# EAGLE design loki (EAGLE 6.2)
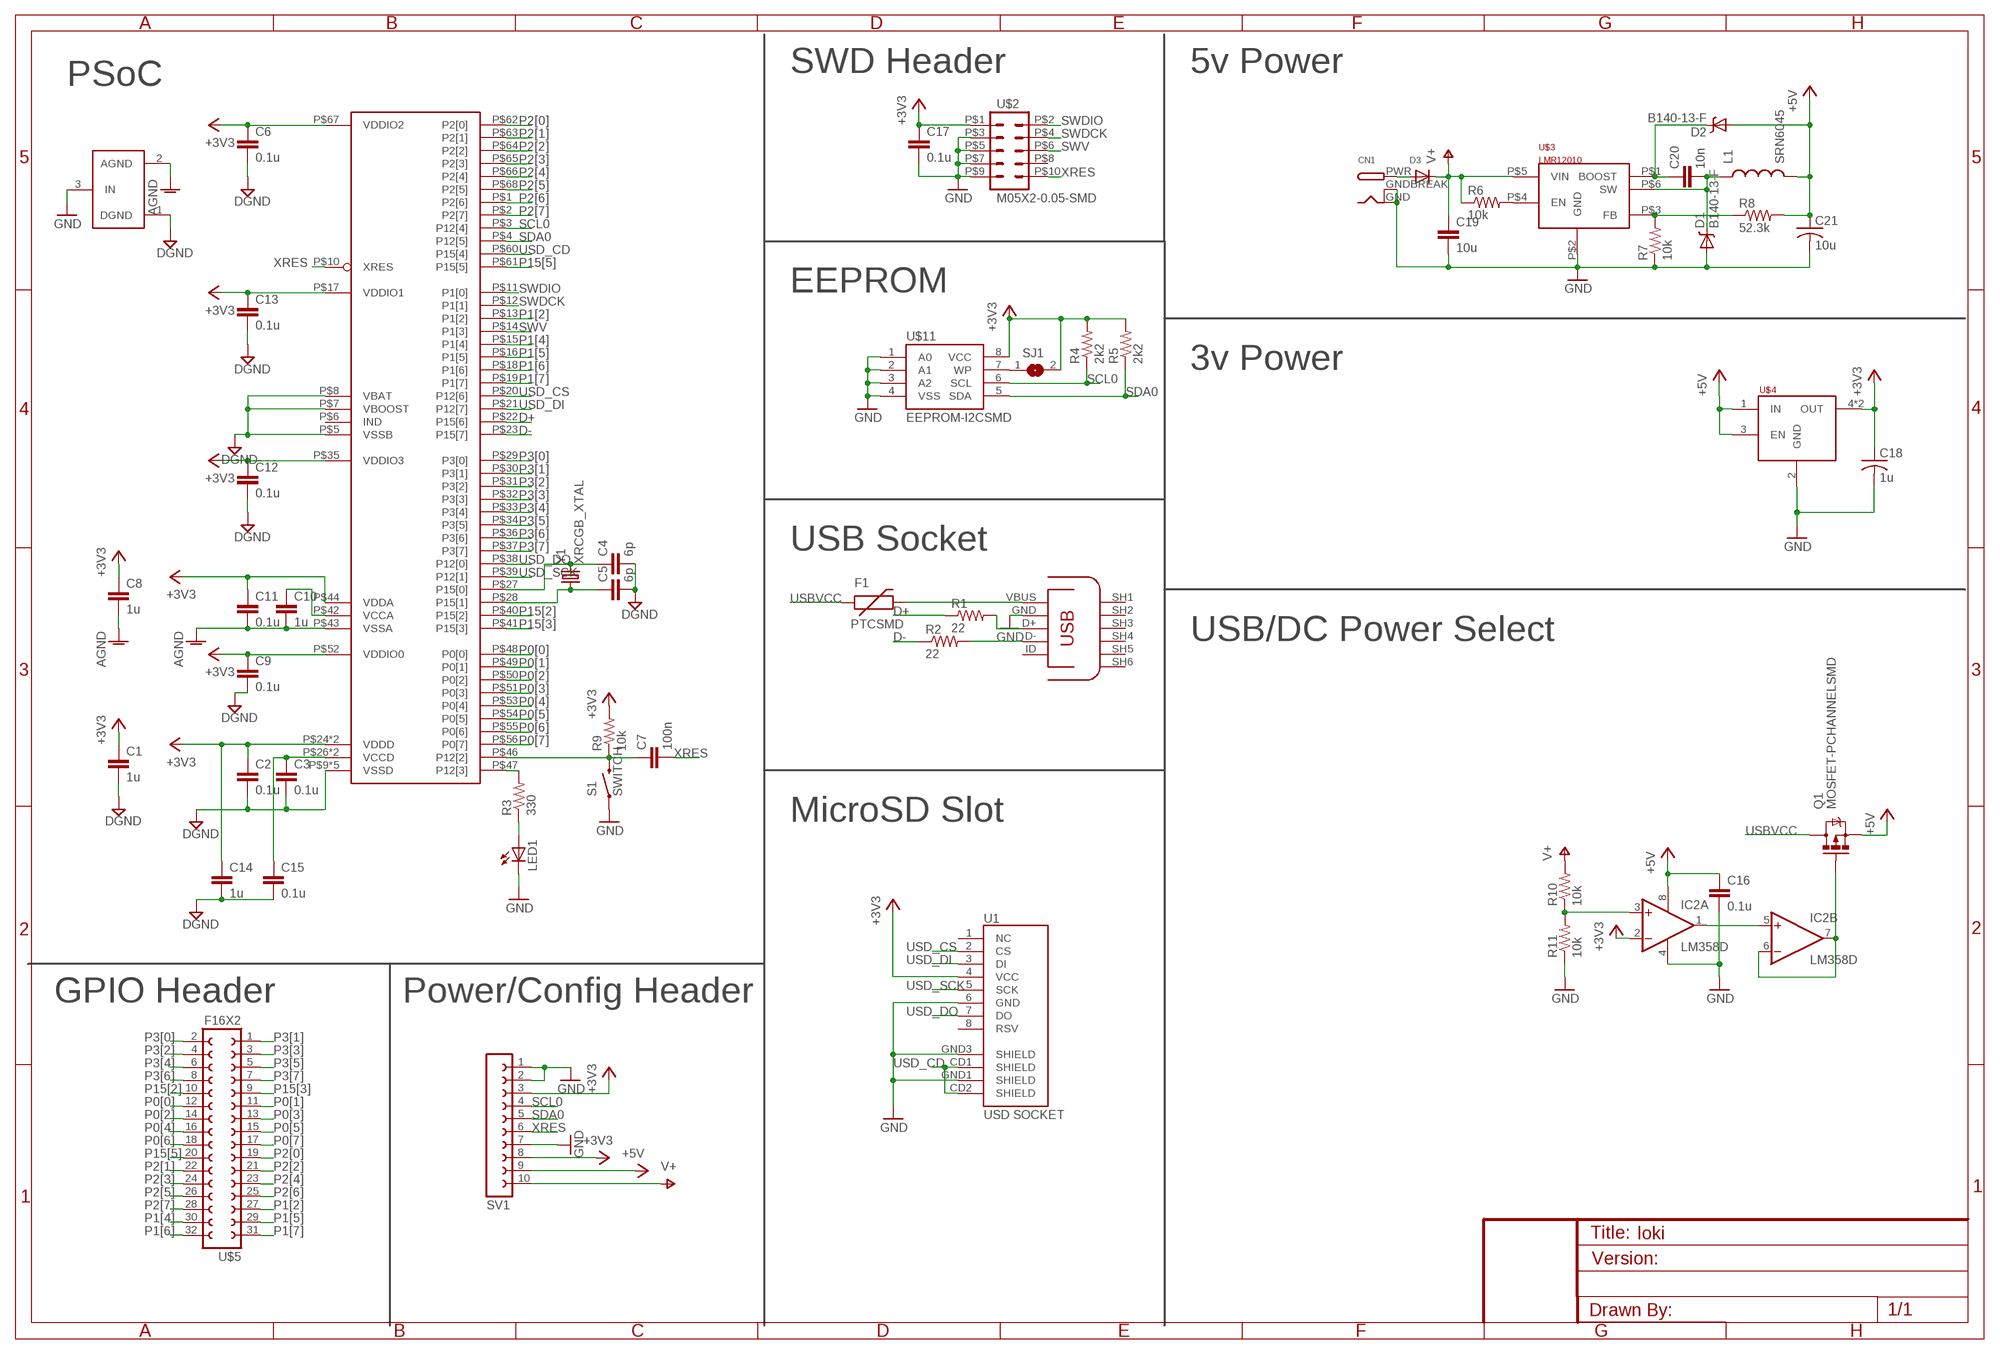
[diagram p0: schematic, sheet 1]

## Parts
C1  1u  C-EUC0603K  [C0603K]
C2  0.1u  C-EUC0603K  [C0603K]
C3  0.1u  C-EUC0603K  [C0603K]
C4  6p  C-EUC0603K  [C0603K]
C5  6p  C-EUC0603K  [C0603K]
C6  0.1u  C-EUC0603K  [C0603K]
C7  100n  C-EUC0603K  [C0603K]
C8  1u  C-EUC0603K  [C0603K]
C9  0.1u  C-EUC0603K  [C0603K]
C10  1u  C-EUC0603K  [C0603K]
C11  0.1u  C-EUC0603K  [C0603K]
C12  0.1u  C-EUC0603K  [C0603K]
C13  0.1u  C-EUC0603K  [C0603K]
C14  1u  C-EUC0603K  [C0603K]
C15  0.1u  C-EUC0603K  [C0603K]
C16  0.1u  CAP0603-CAP  [0603-CAP]
C17  0.1u  C-EUC0603K  [C0603K]
C18  1u  C-USC0603  [C0603]
C19  10u  C-EUC1210  [C1210]
C20  10n  C-EUC0805  [C0805]
C21  10u  C-USC1206  [C1206]
CN1  DCBARRELPTH  [DCJACK_2MM_PTH]
D1  B140-13-F  DIODE-SCHOTTKY_  [SMA-DIODE]
D2  B140-13-F  DIODE-SCHOTTKY_  [SMA-DIODE]
D3  DIODESMA  [SMADIODE]
F1  PTCSMD  [PTC-1206]
IC2  LM358D  [SO08]
L1  SRN6045  [SRN6045]
LED1  LEDCHIP-LED0805  [CHIP-LED0805]
Q1  MOSFET-PCHANNELSMD  [SOT23-3]
R1  22  RESISTOR0603-RES  [0603-RES]
R2  22  RESISTOR0603-RES  [0603-RES]
R3  330  R-US_R0603  [R0603]
R4  2k2  R-US_R0603  [R0603]
R5  2k2  R-US_R0603  [R0603]
R6  10k  R-US_R0603  [R0603]
R7  10k  R-US_R0603  [R0603]
R8  52.3k  R-US_R0603  [R0603]
R9  10k  R-US_R0603  [R0603]
R10  10k  R-US_R0603  [R0603]
R11  10k  R-US_R0603  [R0603]
S1  SWITCH  SWITCH-MOMENTARY-2SMD  [TACTILE_SWITCH_SMD]
SJ1  SJ  [SJ]
SV1  FE10-1  [FE10]
U1  USD SOCKET  USD-SOCKETNEW  [MICRO-SD-SOCKET-PP]
U$1  CY83XXX-68PIN  [QFN68]
U$2  M05X2-0.05-SMD  [PINHD-2X5-0.05-SMD]
U$3  LMR12010  [TSOT-6]
U$4  TLV702XX  [SOT23-5]
U$5  F16X2  [FE16-2]
U$7  MICROUSB  [USB-MICROB]
U$9  GND_CONNECT  [GND_CONNECT]
U$11  EEPROM-I2CSMD  [SO08]
Y1  XRCGB_XTAL  [XRCGB-XTAL]

## Nets
+3V3: C1.1 C2.1 C6.1 C8.1 C9.1 C11.1 C12.1 C13.1 C14.1 C17.1 C18.1 IC2.2(A:-IN) R4.2 R5.2 R9.2 SJ1.2 SV1.3 SV1.8 U1.4(VCC) U$1.P$17(VDDIO1) U$1.P$24(VDDD) U$1.P$35(VDDIO3) U$1.P$44(VDDA) U$1.P$52(VDDIO0) U$1.P$59(VDDD) U$1.P$67(VDDIO2) U$2.P$1 U$4.4(OUT) U$4.5(OUT) U$11.8(VCC)
+5V: C16.1 C21.1 D2.A IC2.8(P:V+) L1.P$2 Q1.2(S) R8.2 SV1.9 U$4.1(IN) U$4.3(EN)
AGND: C8.2 C10.2 C11.2 U$1.P$43(VSSA) U$9.2(AGND)
D+: R1.1 U$1.P$22(P15[6])
D-: R2.1 U$1.P$23(P15[7])
DGND: C1.2 C2.2 C3.2 C4.2 C5.2 C6.2 C9.2 C12.2 C13.2 C14.2 C15.2 U$1.P$5(VSSB) U$1.P$7(VBOOST) U$1.P$8(VBAT) U$1.P$9(VSSD) U$1.P$25(VSSD) U$1.P$45(VSSD) U$1.P$58(VSSD) U$1.P$CENTER(VSSD) U$9.1(DGND)
GND: C16.2 C17.2 C18.2 C19.2 C21.2 CN1.GND CN1.GNDBREAK D1.A IC2.4(P:V-) LED1.C R7.1 R11.1 S1.1 SV1.1 SV1.2 SV1.7 U1.6(GND) U1.GND1(SHIELD) U1.GND3(SHIELD) U$2.P$3 U$2.P$5 U$2.P$7 U$2.P$9 U$3.P$2(GND) U$4.2(GND) U$7.GND U$9.3(IN) U$11.1(A0) U$11.2(A1) U$11.3(A2) U$11.4(VSS)
N$1: C3.1 C15.1 U$1.P$26(VCCD) U$1.P$57(VCCD)
N$2: R2.2 U$7.D-
N$3: C10.1 U$1.P$42(VCCA)
N$4: R1.2 U$7.D+
N$5: R6.2 U$3.P$4(EN)
N$6: C20.1 D2.C U$3.P$1(BOOST)
N$7: C20.2 D1.C L1.P$1 U$3.P$6(SW)
N$8: R7.2 R8.1 U$3.P$3(FB)
N$9: SJ1.1 U$11.7(WP)
N$10: R3.2 U$1.P$47(P12[3])
N$11: CN1.PWR D3.A
N$12: IC2.3(A:+IN) R10.1 R11.2
N$13: IC2.6(B:-IN) IC2.7(B:OUT) Q1.1(G)
N$14: IC2.1(A:OUT) IC2.5(B:+IN)
N$15: F1.2 U$7.VBUS(VCC)
N$16: C4.1 U$1.P$27(P15[0]) Y1.2
N$17: C5.1 U$1.P$28(P15[1]) Y1.1
N$20: C7.1 R9.1 S1.3 U$1.P$46(P12[2])
N$25: LED1.A R3.1
P0[0]: U$1.P$48(P0[0]) U$5.12
P0[1]: U$1.P$49(P0[1]) U$5.11
P0[2]: U$1.P$50(P0[2]) U$5.14
P0[3]: U$1.P$51(P0[3]) U$5.13
P0[4]: U$1.P$53(P0[4]) U$5.16
P0[5]: U$1.P$54(P0[5]) U$5.15
P0[6]: U$1.P$55(P0[6]) U$5.18
P0[7]: U$1.P$56(P0[7]) U$5.17
P1[2]: U$1.P$13(P1[2]) U$5.27
P1[4]: U$1.P$15(P1[4]) U$5.30
P1[5]: U$1.P$16(P1[5]) U$5.29
P1[6]: U$1.P$18(P1[6]) U$5.32
P1[7]: U$1.P$19(P1[7]) U$5.31
P2[0]: U$1.P$62(P2[0]) U$5.19
P2[1]: U$1.P$63(P2[1]) U$5.22
P2[2]: U$1.P$64(P2[2]) U$5.21
P2[3]: U$1.P$65(P2[3]) U$5.24
P2[4]: U$1.P$66(P2[4]) U$5.23
P2[5]: U$1.P$68(P2[5]) U$5.26
P2[6]: U$1.P$1(P2[6]) U$5.25
P2[7]: U$1.P$2(P2[7]) U$5.28
P3[0]: U$1.P$29(P3[0]) U$5.2
P3[1]: U$1.P$30(P3[1]) U$5.1
P3[2]: U$1.P$31(P3[2]) U$5.4
P3[3]: U$1.P$32(P3[3]) U$5.3
P3[4]: U$1.P$33(P3[4]) U$5.6
P3[5]: U$1.P$34(P3[5]) U$5.5
P3[6]: U$1.P$36(P3[6]) U$5.8
P3[7]: U$1.P$37(P3[7]) U$5.7
P15[2]: U$1.P$40(P15[2]) U$5.10
P15[3]: U$1.P$41(P15[3]) U$5.9
P15[5]: U$1.P$61(P15[5]) U$5.20
SCL0: R4.1 SV1.4 U$1.P$3(P12[4]) U$11.6(SCL)
SDA0: R5.1 SV1.5 U$1.P$4(P12[5]) U$11.5(SDA)
SWDCK: U$1.P$12(P1[1]) U$2.P$4
SWDIO: U$1.P$11(P1[0]) U$2.P$2
SWV: U$1.P$14(P1[3]) U$2.P$6
USBVCC: F1.1 Q1.3(D)
USD_CD: U1.CD1(SHIELD) U1.CD2(SHIELD) U$1.P$60(P15[4])
USD_CS: U1.2(CS) U$1.P$20(P12[6])
USD_DI: U1.3(DI) U$1.P$21(P12[7])
USD_DO: U1.7(DO) U$1.P$38(P12[0])
USD_SCK: U1.5(SCK) U$1.P$39(P12[1])
V+: C19.1 D3.C R6.1 R10.2 SV1.10 U$3.P$5(VIN)
XRES: C7.2 SV1.6 U$1.P$10(XRES) U$2.P$10
Unconnected: U1.1(NC) U1.8(RSV) U$2.P$8 U$7.ID U$7.SH1(SH) U$7.SH2(SH) U$7.SH3(SH) U$7.SH4(SH) U$7.SH5(SH) U$7.SH6(SH)

## Notes on the sheet
- SWD Header | 5v Power
- PSoC
- EEPROM
- 3v Power
- USB Socket
- USB/DC Power Select
- MicroSD Slot
- GPIO Header | Power/Config Header

## Power pins joined to a net without a drawn wire
IND: U$1.P$6(IND)

## Library data of the parts
C1-C15 C17 C19 C20 = resistor:C-EU: CAPACITOR, European symbol
C16 = SparkFun-Passives:CAP: Capacitor Standard 0603 ceramic capacitor, and 0.1" leaded capacitor.
C18 C21 = resistor:C-US: CAPACITOR, American symbol
CN1 = adafruit:DCBARREL: 2.0mm DC Barrel Jack DCJACK_2MM_PTH - Through Hole Jack (4UConnector: 05537)
D1 D2 = SparkFun-DiscreteSemi:DIODE-SCHOTTKY: Commonly MBRA140.
D3 = adafruit:DIODE: Diode SMADIODE - SMA Surface Mount Package 20V 1A Schottky Diode Digikey: 641-1014-6-ND DO-1N4148 - Through Hole Small Current Diode SOD-123 20V 1 A (.5mV Vf) Schottky Diode - Digikey: MBRX120TPMSCT-ND SOD-323 10V 570mA (.38mV Vf, 3ns) Schottky Diode - Digikey: ZLLS410CT-ND SOD-523 30V 30mA Schottky Diode (RB751S-40TE61) - Digikey: RB751S-40TE61CT-ND SOT23-R/W - SOT23 Package (R = Solder Paste/Reflow Ovens, W = Hand-Soldering) BAT54Film 40V 300mA - Digikey: 497-7162-1-ND
F1 = SparkFun-PowerIC:PTC: Resettable Fuse PTC Resettable Fuse. Spark Fun Electronics SKU : COM-08357
IC2 = linear:LM358: OP AMP also LM158; LM258; LM2904 Source: http://cache.national.com/ds/LM/LM158.pdf
L1 = nickparts:SRN6045
LED1 = led:LED: LED OSRAM: - CHIPLED LG R971, LG N971, LY N971, LG Q971, LY Q971, LO R971, LY R971 LH N974, LH R974 LS Q976, LO Q976, LY Q976 LO Q996 - Hyper CHIPLED LW Q18S LB Q993, LB Q99A, LB R99A - SideLED LS A670, LO A670, LY A670, LG A670, LP A670 LB A673, LV A673, LT A673, LW A673 LH A674 LY A675 LS A676, LA A676, LO A676, LY A676, LW A676 LS A679, LY A679, LG A679 - Hyper Micro SIDELED® LS Y876, LA Y876, LO Y876, LY Y876 LT Y87S - SmartLED LW L88C, LW L88S LB L89C, LB L89S, LG L890 LS L89K, LO L89K, LY L89K LS L896, LA L896, LO L896, LY L896 - TOPLED LS T670, LO T670, LY T670, LG T670, LP T670 LSG T670, LSP T670, LSY T670, LOP T670, LYG T670 LG T671, LOG T671, LSG T671 LB T673, LV T673, LT T673, LW T673 LH T674 LS T676, LA T676, LO T676, LY T676, LB T676, LH T676, LSB T676, LW T676 LB T67C, LV T67C, LT T67C, LS T67K, LO T67K, LY T67K, LW E67C LS E67B, LA E67B, LO E67B, LY E67B, LB E67C, LV E67C, LT E67C LW T67C LS T679, LY T679, LG T679 LS T770, LO T770, LY T770, LG T770, LP T770 LB T773, LV T773, LT T773, LW T773 LH T774 LS E675, LA E675, LY E675, LS T675 LS T776, LA T776, LO T776, LY T776, LB T776 LHGB T686 LT T68C, LB T68C - Hyper Mini TOPLED® LB M676 - Mini TOPLED Santana® LG M470 LS M47K, LO M47K, LY M47K Source: http://www.osram.convergy.de LUXEON: - LUMILED® LXK2-PW12-R00, LXK2-PW12-S00, LXK2-PW14-U00, LXK2-PW14-V00 LXK2-PM12-R00, LXK2-PM12-S00, LXK2-PM14-U00 LXK2-PE12-Q00, LXK2-PE12-R00, LXK2-PE12-S00, LXK2-PE14-T00, LXK2-PE14-U00 LXK2-PB12-K00, LXK2-PB12-L00, LXK2-PB12-M00, LXK2-PB14-N00, LXK2-PB14-P00, LXK2-PB14-Q00 LXK2-PR12-L00, LXK2-PR12-M00, LXK2-PR14-Q00, LXK2-PR14-R00 LXK2-PD12-Q00, LXK2-PD12-R00, LXK2-PD12-S00 LXK2-PH12-R00, LXK2-PH12-S00 LXK2-PL12-P00, LXK2-PL12-Q00, LXK2-PL12-R00 Source: www.luxeon.com KINGBRIGHT: KA-3528ASYC Source: www.kingbright.com
Q1 = SparkFun-DiscreteSemi:MOSFET-PCHANNEL: Generic PMOSFET
R1 R2 = SparkFun-Passives:RESISTOR: Resistor Basic schematic elements and footprints for 0603, 1206, and PTH resistors.
R3-R11 = resistor:R-US_: RESISTOR, American symbol
S1 = SparkFun-Electromechanical:SWITCH-MOMENTARY-2: Various NO switches- pushbuttons, reed, etc
SJ1 = jumper:SJ: SMD solder JUMPER
SV1 = con-lsta:FE10-1: FEMALE HEADER; OC_FARNELL: unknown; OC_NEWARK: unknown
U1 = SparkFun-Connectors:USD-SOCKET: microSD Socket Push-push type uSD socket. Schematic element and footprint production proven. Spark Fun Electronics SKU : PRT-00127. tDoc lines correctly indicate media card edge positions when inserting (unlocked, locked, depressed).
U$1 = cypress_psoc_V1_0:CY83XXX-68PIN
U$2 = nickparts:M05X2-0.05-SMD
U$3 = nickparts:LMR12010
U$4 = nickparts:TLV702XX
U$5 = nickparts:F16X2
U$7 = ondraster:MICROUSB
U$9 = SparkFun-Passives:GND_CONNECT: Use to make a connection of multiple grounds in only one place.
U$11 = SparkFun-DigitalIC:EEPROM-I2C: I2C EEPROM chips, 24LC256 (and others)
Y1 = nickparts:XRCGB_XTAL

## Board
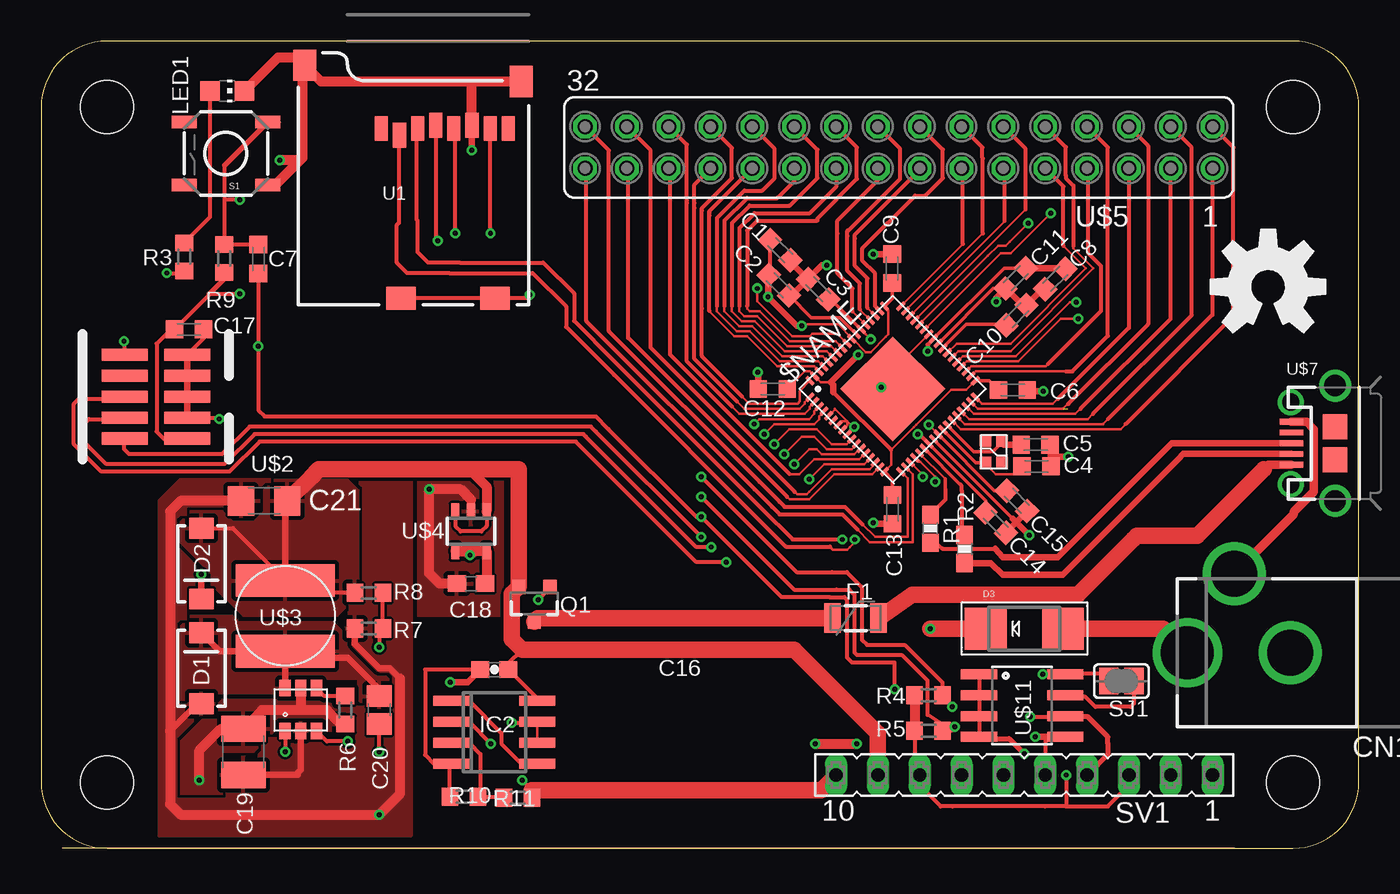
[diagram p1: board, top side]
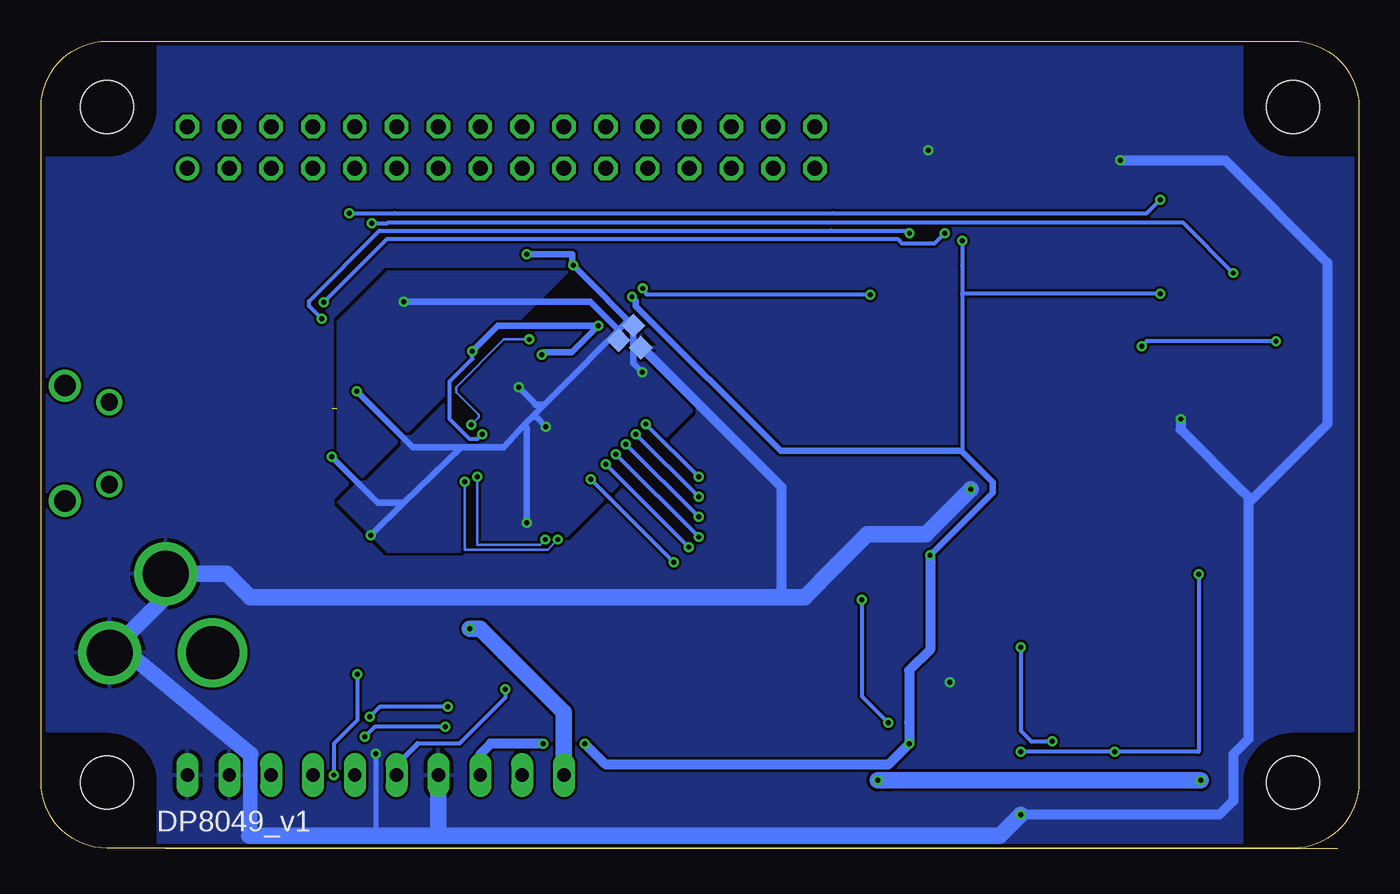
[diagram p2: board, bottom side, seen from below]

Size 80 x 49 mm. Coordinates in mm from the lower left corner, seen from the top.
Outline: 72.47,0 1.27,0
Copper layers (1*16): Top 0.035mm / dielectric 1.5mm / Bottom 0.035mm
Design rules: minimum track width 6mil, minimum drill 0.3mm, track to track 6mil, track to pad 6mil, pad to pad 6mil, via to via 6mil, smd to smd 0mil, copper to edge 10mil, drill to drill 10mil, minimum pad ring 10mil, minimum via ring 6mil, stop-mask expansion 2mil, vias tented up to drill 100mil, thermal gap 10mil

### Footprints (pad centres in the part's own frame; a part is rotated, then mirrored left to right if it is on the bottom)
C0603K = smd 1.05 x 1.08: 1 -0.875,0; 2 0.875,0
0603-CAP = smd 1.1 x 1: 1 -0.85,0; 2 0.85,0
C0603 = smd 1.1 x 1: 1 -0.85,0; 2 0.85,0
C1210 = smd 1.6 x 2.7: 1 -1.4,0; 2 1.4,0
C0805 = smd 1.3 x 1.5: 1 -0.85,0; 2 0.85,0
C1206 = smd 1.6 x 1.8: 1 -1.4,0; 2 1.4,0
DCJACK_2MM_PTH = drill 2.8: GND 0,7.35; GNDBREAK 4.8,10.75 | drill 3.2: PWR 0,13.6
SMA-DIODE = smd 1.27 x 1.47: A -2.15,0; C 2.15,0
SMADIODE = smd 2.54 x 2.54: A 2.349,0; C -2.349,0
PTC-1206 = smd 1 x 1.8: 1 -1.4,0; 2 1.4,0
SO08 = smd 0.6 x 2.2: 1 -1.905,-2.6; 2 -0.635,-2.6; 3 0.635,-2.6; 4 1.905,-2.6; 5 1.905,2.6; 6 0.635,2.6; 7 -0.635,2.6; 8 -1.905,2.6
SRN6045 = smd 2 x 6: P$1 -2.15,0; P$2 2.15,0
CHIP-LED0805 = smd 1.2 x 1.2: A 0,-1.05; C 0,1.05
SOT23-3 = smd 0.8 x 0.9: 1 -0.95,-1; 2 0.95,-1; 3 0,1.1
0603-RES = smd 1.1 x 1: 1 -0.85,0; 2 0.85,0
R0603 = smd 1 x 1.1: 1 -0.85,0; 2 0.85,0
TACTILE_SWITCH_SMD = smd 1.524 x 0.762: 1 -2.54,1.905; 2 2.54,1.905; 3 -2.54,-1.905; 4 2.54,-1.905
SJ = smd 1.168 x 1.6: 1 -0.762,0; 2 0.762,0
FE10 = drill 0.813 long: 1 -11.43,0; 2 -8.89,0; 3 -6.35,0; 4 -3.81,0; 5 -1.27,0; 6 1.27,0; 7 3.81,0; 8 6.35,0; 9 8.89,0; 10 11.43,0
MICRO-SD-SOCKET-PP = smd 0.8 x 1.5: 1 -8.94,10.7; 2 -7.84,10.3; 3 -6.74,10.7; 4 -5.64,10.9; 5 -4.54,10.7; 6 -3.44,10.9; 7 -2.34,10.7; 8 -1.24,10.7 | smd 1.8 x 1.4: CD1 -2.05,0.4; CD2 -7.75,0.4 | smd 1.4 x 1.9: GND1 -13.6,14.55; GND3 -0.45,13.55
QFN68 = smd 0.6 x 0.2: P$1 0.1,7.2; P$2 0.1,6.8; P$3 0.1,6.4; P$4 0.1,6; P$5 0.1,5.6; P$6 0.1,5.2; P$7 0.1,4.8; P$8 0.1,4.4; P$9 0.1,4; P$10 0.1,3.6; P$11 0.1,3.2; P$12 0.1,2.8; P$13 0.1,2.4; P$14 0.1,2; P$15 0.1,1.6; P$16 0.1,1.2; P$17 0.1,0.8; P$35 7.9,0.8; P$36 7.9,1.2; P$37 7.9,1.6; P$38 7.9,2; P$39 7.9,2.4; P$40 7.9,2.8; P$41 7.9,3.2; P$42 7.9,3.6; P$43 7.9,4; P$44 7.9,4.4; P$45 7.9,4.8; P$46 7.9,5.2; P$47 7.9,5.6; P$48 7.9,6; P$49 7.9,6.4; P$50 7.9,6.8; P$51 7.9,7.2 | smd 0.2 x 0.6: P$18 0.8,0.1; P$19 1.2,0.1; P$20 1.6,0.1; P$21 2,0.1; P$22 2.4,0.1; P$23 2.8,0.1; P$24 3.2,0.1; P$25 3.6,0.1; P$26 4,0.1; P$27 4.4,0.1; P$28 4.8,0.1; P$29 5.2,0.1; P$30 5.6,0.1; P$31 6,0.1; P$32 6.4,0.1; P$33 6.8,0.1; P$34 7.2,0.1; P$52 7.2,7.9; P$53 6.8,7.9; P$54 6.4,7.9; P$55 6,7.9; P$56 5.6,7.9; P$57 5.2,7.9; P$58 4.8,7.9; P$59 4.4,7.9; P$60 4,7.9; P$61 3.6,7.9; P$62 3.2,7.9; P$63 2.8,7.9; P$64 2.4,7.9; P$65 2,7.9; P$66 1.6,7.9; P$67 1.2,7.9; P$68 0.8,7.9 | smd 4.5 x 4.5: P$CENTER 4,4
PINHD-2X5-0.05-SMD = smd 2.794 x 0.737: P$1 1.27,5.08; P$2 5.08,5.08; P$3 1.27,3.81; P$4 5.08,3.81; P$5 1.27,2.54; P$6 5.08,2.54; P$7 1.27,1.27; P$8 5.08,1.27; P$9 1.27,0; P$10 5.08,0
TSOT-6 = smd 0.69 x 1: P$1 0,0; P$2 0.95,0; P$3 1.9,0; P$4 1.9,2.6; P$5 0.95,2.6; P$6 0,2.6
SOT23-5 = smd 0.5 x 1: 1 -0.95,-1.2; 2 0,-1.2; 3 0.95,-1.2; 4 0.95,1.2; 5 -0.95,1.2
FE16-2 = drill 0.914: 1 1.27,3.81 | drill 0.914 octagon: 2 1.27,1.27; 3 3.81,3.81; 4 3.81,1.27; 5 6.35,3.81; 6 6.35,1.27; 7 8.89,3.81; 8 8.89,1.27; 9 11.43,3.81; 10 11.43,1.27; 11 13.97,3.81; 12 13.97,1.27; 13 16.51,3.81; 14 16.51,1.27; 15 19.05,3.81; 16 19.05,1.27; 17 21.59,3.81; 18 21.59,1.27; 19 24.13,3.81; 20 24.13,1.27; 21 26.67,3.81; 22 26.67,1.27; 23 29.21,3.81; 24 29.21,1.27; 25 31.75,3.81; 26 31.75,1.27; 27 34.29,3.81; 28 34.29,1.27; 29 36.83,3.81; 30 36.83,1.27; 31 39.37,3.81; 32 39.37,1.27
USB-MICROB = smd 0.35 x 1.4: D+ 0,2.65; D- -0.65,2.65; GND 1.3,2.65; ID 0.65,2.65; VBUS -1.3,2.65 | drill 1.3 pad 1.6: SH1 -3.5,0; SH2 3.5,0 | drill 1.05 pad 1.4: SH3 2.5,2.7; SH4 -2.5,2.7 | smd 1.5 x 1.5: SH5 -1,0; SH6 1,0
GND_CONNECT = smd 1.016 x 1.016: 1 -1.016,0; 2 -1.016,-1.27; 3 0.254,-0.635
SO08' = smd 0.61 x 2.21: 1 -1.905,-2.616; 2 -0.635,-2.616; 3 0.635,-2.616; 4 1.905,-2.616; 5 1.905,2.616; 6 0.635,2.616; 7 -0.635,2.616; 8 -1.905,2.616
DP8049_V1 = hole 3.2: 4,4; 76,4; 76,45; 4,45
XRCGB-XTAL = smd 0.75 x 0.7: 1 -0.675,0.5; 2 0.675,-0.5; NC1 0.675,0.5; NC2 -0.675,-0.5

### Placement (x,y rotation side)
C1  44.87,36.31 315 top
C2  44.79,34.18 315 top
C3  47.17,33.93 135 top
C4  60.43,23.18 0 top
C5  60.38,24.5 0 top
C6  59,27.82 0 top
C7  13.18,35.77 270 top
C8  61.57,34.56 225 top
C9  51.66,35.2 90 top
C10  59.21,32.37 45 top
C11  59.17,34.61 225 top
C12  44.42,27.88 180 top
C13  51.68,20.57 270 top
C14  57.96,19.77 315 top
C15  59.24,21.09 315 top
C16  27.52,10.86 180 top
C17  8.98,31.51 0 top
C18  26.1,16.07 180 top
C19  12.27,5.85 270 top
C20  20.52,8.39 90 top
C21  13.54,21.09 180 top
CN1  83.19,11.87 90 top
D1  9.73,10.93 90 top
D2  9.73,17.28 270 top
D3  59.69,13.34 0 top
F1  49.44,13.97 0 top
IC2  27.52,7.04 270 top
L1  14.81,14.11 90 top
LED1  11.3,45.98 270 top
Q1  29.94,14.86 180 top
R1  53.98,19.41 270 top
R2  56.06,18.17 270 top
R3  8.69,35.91 270 top
R4  53.88,9.29 180 top
R5  53.88,7.14 180 top
R6  18.47,8.39 90 top
R7  19.89,13.34 0 top
R8  19.89,15.5 180 top
R9  11.12,35.81 270 top
R10  28.94,3.07 0 top
R11  25.67,3.13 0 top
S1  11.21,42.19 180 top
SJ1  65.58,10.15 180 top
SV1  59.69,4.45 180 top
U1  29.6,32.99 0 top
U$1  51.7,22.23 45 top
U$2  10.14,29.96 180 top
U$3  14.81,7.12 0 top
U$4  26.1,19.25 180 top
U$5  72.39,45.09 180 top
U$6  [LOKI_LOGO]  39.78,14.02 0 top
U$7  78.56,24.59 90 top
U$9  43.33,31.02 315 bottom
U$11  EEPROM-I2CSMD  [SO08']  59.56,8.66 270 top
U$12  [OSHW-LOGO-L]  74.49,34.08 0 top
U$13  [DP8049_V1]  0,0 0 top
Y1  57.83,24.07 270 top

### Tracks (layer width: path | path; a pad name or v marks a point on that pad's centre or on a via)
+3V3  (via drill 0.3, 0.3 pad 0.25)
  Top 0.152: v46.19,31.73 45.96,31.8 48.4,31.8 49.22,30.98 U$1.P$59 49.27,30.93 50.07,30.13 50.38,30.13 51.29,31.04 51.44,31.19 51.44,32.66 U$1.P$52 | 44.13,34.76 C2.1 | U$1.P$67 47.32,28.3 47.94,28.3 | U$1.P$67 47.18,28.45 | U$1.P$17 51.2,22.88 51.6,23.27 51.6,24.18 52.97,25.55 53.12,25.71 55.25,27.84 56.17,27.84 56.18,27.84 U$1.P$35 | U$1.P$67 46.67,28.96 46.36,28.96 C12.1
  Top 0.203: C11.1 58.47,35.23 U$1.P$44 | C14.1 57.34,21.11 U$1.P$24 | C9.1 51.66,33.37 U$1.P$52 | U$1.P$17 51.68,22.38 C13.1 | C6.1 57.56,28.38 U$1.P$35
  Top 0.254: 62.23,2.54 60.96,2.54 | 60.96,2.54 55.33,2.54 54.61,2.54 53.34,3.81 53.34,4.37 SV1.8 53.03,4.75 R5.2 | 51.6,24.18 48.09,27.69 | U$1.P$44 53.83,30.58 v53.83,30.18 | U$1.P$24 53.37,25.08 v53.22,25.15 | v60.81,10.57 v60.81,10.56 U$11.8 62.24,10.63 64.34,10.63 SJ1.2 | 62.23,2.54 60.96,2.54 | v62.23,4.45 62.23,2.54 | IC2.2 25.98,7.68 v27.3,6.35 | U1.4 23.96,37 | 23.96,37 v24.08,36.88 | v24.08,36.88 24.13,36.83 | C1.1 44.25,34.88 C2.1 | U$2.P$1 8.84,24.84 7.47,24.84 7.01,25.3 7.01,30.63 7.88,31.51 C17.1 9.89,33.29 | 23.96,37 v24.08,36.88 | 62.23,2.54 64.77,2.54 66.04,3.81 SV1.3 | 11.12,34.52 9.89,33.29 | 11.12,34.52 R9.2 11.12,34.61 10.16,33.66 v12.06,33.66 | 11.12,34.52 9.89,33.29
  Top 0.406: v44.13,33.48 44.13,34.76 | v49.62,29.98 47.94,28.3 48.09,28.15 48.09,27.69 | C11.1 62.15,35.23 C8.1 | v44.13,33.48 44.52,33.09 | 44.52,33.09 45.88,31.73 v46.19,31.73 | v44.13,33.48 44.52,33.09
  Top 0.61: U$4.5 27.05,16.17 C18.1 | U$4.5 U$4.4 25.77,18.05 v26.04,17.78 26.3,18.05 U$4.5 | R4.2 R5.2 | v46.99,6.35 v49.53,6.35
  Bottom 0.254: v53.83,30.18 53.83,29.72 55.2,28.35 55.2,26.06 54.28,25.15 53.98,24.84 53.52,24.84 v53.22,25.15 | v60.81,10.57 60.81,7.77 62.23,6.35 v62.23,4.45 | v27.3,6.35 27.3,7.62 | v24.08,36.88 24.08,35.36 24.08,33.66 | 24.08,33.66 24.08,24.08 23.81,23.81 | v12.06,33.66 24.08,33.66
  Bottom 0.406: v49.62,29.98 49.46,30.13 47.79,30.13 v46.19,31.73 52.27,31.73 v53.83,30.18 | v26.04,17.78 22.23,21.59 22.23,22.23 23.81,23.81 24.13,24.13 35.1,24.13 43.89,32.92 43.89,33.24 v44.13,33.48
  Bottom 0.61: v26.04,17.78 26.04,12.06 27.3,10.79 27.3,7.62 v27.3,6.35 28.57,5.08 45.72,5.08 v46.99,6.35 | v49.53,6.35 52.7,6.35 53.34,5.71 SV1.8
+5V
  Top 0.254: D2.A 11.63,19.43 L1.P$2 15.56,15.5 R8.2 | U$4.1 27.05,19.56 26.73,19.25 25.46,19.25 25.14,19.56 U$4.3 | IC2.8 30.11,9.11 C16.1 28.36,11.22 29.21,12.06
  Top 0.406: L1.P$2 14.81,20.96 C21.1 | Q1.2
  Top 0.61: 15.13,21.28 C21.1 | 16.85,23 17,23 | 26,23 27.05,21.95 U$4.1
  Top 1.016: 15.13,21.28 16.36,22.51 16.85,23 | 17,23 26,23 29,23 29,19 Q1.2 | Q1.2 28.57,15.44 28.57,12.7 29.21,12.06 43.81,12.06 45.09,12.06 45.72,12.06 50.8,6.99 SV1.9
  pour Top (rank 4): 17.98,14.11 12.27,14.11 10.37,16.01 10.37,16.64 8.46,18.55 8.46,19.82 9.1,20.45 11,20.45 11.63,19.82 12.9,19.82 13.54,20.45 13.54,21.73 14.18,22.36 18.62,22.36 19.25,21.73 19.25,15.38
AGND  (via drill 0.3 pad 0.25)
  Top 0.152: C11.2 57.8,33.99
  Top 0.203: 57.8,33.99 U$1.P$43
  Top 0.406: C8.2 60.79,33.95 C10.2 59.55,32.98 C11.2 | 58.45,33.94 58.45,33.63 58.45,33.94 | v58,33.17 58,33.43 C11.2 | C11.2 58.51,33.99 58.45,33.94
  Bottom 0.406: U$9.2 44.94,31.45 46.67,33.17 v58,33.17
  pour Bottom (rank 2): 48,35 62,21 62,32 59,35
D+
  Top 0.152: U$1.P$22 54.89,22.43
  Top 0.203: 54.89,22.43 54.89,21.79
  Top 0.254: 54.89,21.79 54.89,21.17 R1.1
D-
  Top 0.203: U$1.P$23 55.81,22.08
  Top 0.254: R2.1 55.88,19.3 55.88,21.72 55.88,22 55.81,22.08
DGND  (via drill 0.3, 0.3 pad 0.25)
  Top 0.152: U$1.P$58 49.49,31.21 | 58.88,20.14 58.88,20.12 59.21,19.79 | U$1.P$25 54.17,24.83 59,20 | U$1.P$45 52.66,29.98 52.51,29.98 51.7,29.16 U$1.P$CENTER | U$1.P$9 49.31,25.5 v49.36,25.59 49.26,25.59 48.93,25.93 | U$1.P$5 48.19,26.64 48.19,26.67 48.93,25.93 | U$1.P$8 48.93,25.68 48.93,25.93 | U$1.P$7 48.61,25.93 48.93,25.93
  Top 0.203: 49.49,31.21 48.5,32.2 46.77,32.2 C2.2 | 58.88,20.14 U$1.P$25
  Top 0.406: C2.2 45.56,33.56 C3.2 | C1.2 45.49,35.62 C3.2 | C15.2 59.86,20.43 59.21,19.79 C14.2 | C12.2 43.54,28.89 v43.52,28.91 | C9.2 v50.53,36.07 | C13.2 50.6,19.7 v50.53,19.76 | 59,20 v60,19 | U$1.P$CENTER 51.58,28 v51,28 | C6.2 59.96,27.74 v60.84,27.74 | C5.2 61.31,24.45 C4.2 61.29,23.2 61.29,23.77 v62.36,23.77 | C3.2 47.39,35.39 v47.7,35.39
  Bottom 0.406: v50.53,36.07 47.77,36.07 47.77,35.46 v47.7,35.39 | 49.2,27.2 49.46,26.93 50,26.93 50,27 v51,28 | 56.85,24.34 55,24.34 | 55,24.34 54.49,24.34 | 54.49,24.34 51.9,24.34 50.7,25.7 | 50.7,25.7 50.2,26.2 | 50.2,26.2 49.2,27.2 | v50.53,19.76 50.53,25.53 50.7,25.7 | v60,19 59.98,19 57.99,20.99 | 57.99,20.99 54.49,24.34 | v49.36,25.59 49.95,26.2 50.2,26.2 | 57.39,24.34 56.85,24.34 | 56.85,24.34 55,24.34 | v43.52,28.91 43.74,29.13 44.04,29.43 U$9.1 | 49.2,27.2 44.35,32.04 U$9.1 | U$9.1 47.15,34.85 | 47.15,34.85 v47.7,35.39 | v60.84,27.74 57.44,24.34 57.39,24.34 | 57.39,24.34 56.85,24.34 | v62.36,23.77 59.58,20.99 57.99,20.99 | v47.7,35.39 47.15,34.85
  pour Bottom (rank 3): 62,21 48,35 40,27 49,18 59,18
GND  (via drill 0.3, 0.3 pad 0.25)
  Top 0.152: C16.2 26.66,10.85 | 23.84,5.14 IC2.4
  Top 0.254: 26.66,10.85 23.32,10.85 23.32,5.66 23.84,5.14 | U$11.1 U$11.2 U$11.3 U$11.4 57.04,6.66 | R11.1 24.82,5.04 IC2.4 | C17.2 9.85,30.93 U$2.P$9 | U$2.P$3 10.73,26.15 v10.82,26.06
  Top 0.305: 57.04,6.66 58.77,6.66 v59.69,5.74
  Top 0.406: C19.2 15.45,4.45 | 15.45,4.45 15.57,4.45 | U$3.P$2 15.76,4.76 15.45,4.45 | D1.A 9.48,8.78 7.83,7.12 | R7.1 19.04,12.41 20.52,10.93 21.16,10.93 21.8,10.29 | U$4.2 26.09,21.15 | C16.2 25.89,10.08 v24.84,10.08 | U1.6 26.14,43.88 v26.14,42.37 | U$2.P$3 U$2.P$5 U$2.P$7 U$2.P$9
  Top 0.508: U$7.GND 76.83,25.89 77.27,25.45 77.27,21.95 77.27,21.64 76.05,20.42 76.05,20.28 CN1.GNDBREAK
  Top 0.61: C21.2 8.46,21.09 7.83,20.45 7.83,7.12 7.83,2.67 8.46,2.04 v20.52,2.04 21.8,3.31 21.8,10.29 | 26.09,21.15 25.46,21.79 v23.55,21.79 23.55,16.7 | C18.2 24.19,16.07 23.55,16.7 | U1.GND1 15.53,48.01 14.38,48.01 LED1.C | 23.55,16.7 24,16.26 | U1.GND3 26.04,46.55 | 26.04,46.55 17,46.55 U1.GND1 | U1.6 26.16,46.42 26.04,46.55 | U1.GND1 15.88,47.42 15.88,41.91 14.24,40.28 S1.1 14.22,40.28 15.7,41.76 v14.48,41.76
  Bottom 0.305: v59.69,5.74 59.69,0.71
  Bottom 0.61: U$9.3 43.5,30.39 35.05,21.95 35.05,15.37 34.92,15.24 | v10.82,26.06 10.82,25.43 6.99,21.59 6.96,21.59 6.71,21.34 6.71,20.95 | 6.71,20.95 6.71,6.63 7.62,5.71 7.62,2.88 8.46,2.04 v20.52,2.04 | v14.48,41.76 8.1,41.76 1.91,35.56 1.91,25.76 6.71,20.95
  Bottom 0.889: 67.31,5.71 67.31,0.81
  Bottom 1.016: 67.31,5.71 74.73,11.87 CN1.GND 72.44,15.27 CN1.GNDBREAK 68.74,16.67 67.31,15.24 34.92,15.24 33.66,15.24 31.75,17.14 29.84,19.05 26.29,19.05 v23.55,21.79 | 67.31,0.81 67.36,0.76 55.88,0.76 | 55.88,0.76 21.8,0.76 v20.52,2.04 | SV1.7 55.88,0.76
  pour Top (rank 6): 22.43,0.77 7.19,0.77 7.19,21.09 8.46,22.36 22.43,22.36
  pour Bottom (rank 4): 0,0 0,49 80,49 80,0
  pour Top: 28,14.17 28,22.42 22.92,22.42 22.92,14.17
N$1  (via drill 0.3 pad 0.25)
  Top 0.152: C3.1 47.96,33.31 | 50.07,31.19 49.79,31.48 U$1.P$57 50.23,31.05 v50.38,30.89 | v53.88,25.71 54.03,25.55 U$1.P$26
  Top 0.203: 47.96,33.31 U$1.P$57 | C15.1 57.87,21.71 U$1.P$26
  Bottom 0.152: v53.88,25.71 53.43,26.16 53.43,26.32 54.8,27.69 54.8,27.99 51.9,30.89 v50.38,30.89
N$2
  Top 0.406: R2.2 57.66,17.32 58.37,16.61 62.03,16.61 69.04,23.62 69.35,23.94 U$7.D-
N$3
  Top 0.152: U$1.P$42 54.74,30.37 | 58.53,31.8 C10.1
  Top 0.203: 54.74,30.37 56.17,31.8 58.53,31.8
N$4
  Top 0.254: R1.2 54.29,18.56 54.71,18.19 57.91,18.19
  Top 0.406: 57.91,18.19 58.37,17.68 61.72,17.68 68.58,24.54 68.63,24.59 U$7.D+
N$5
  Top 0.254: R6.2 17.19,9.24 U$3.P$4
N$6  (via drill 0.3)
  Top 0.254: U$3.P$1 v14.81,5.85 | v20.52,5.85 C20.1
  Top 0.406: D2.C v9.73,16.64
  Bottom 0.254: v20.52,5.85 v14.81,5.85 9.73,5.85 v9.73,16.64
N$7
  Top 0.406: U$3.P$6 L1.P$1 | L1.P$1 10.86,11.96 D1.C | C20.2 20.52,9.66 18.62,11.56 15.2,11.56 L1.P$1
  pour Top (isolate 0.254, rank 5): 8.46,13.47 8.46,9.03 15.45,9.03 15.45,10.29 19.25,10.29 19.25,9.03 19.89,8.39 21.16,8.39 21.8,9.03 21.8,9.66 17.35,14.11 9.1,14.11
N$8  (via drill 0.3)
  Top 0.254: R8.1 R7.2 20.74,13.05 20.52,12.84 v20.52,12.2 | v18.62,6.49 17.34,6.49 U$3.P$3
  Bottom 0.254: v20.52,12.2 20.52,7.12 19.89,6.49 v18.62,6.49
N$9
  Top 0.254: 62.23,9.35 U$11.7 62.28,9.2 63.4,9.2 64.01,8.59 66.14,8.59 66.35,8.79 SJ1.1
N$10  (via drill 0.3)
  Top 0.152: v59.92,37.95 58.8,36.83 58.55,36.58 58.09,36.58 57.48,35.97 53.32,31.81 U$1.P$47
  Top 0.254: v7.62,34.92 8.56,34.92 R3.2
  Bottom 0.152: 58.96,37.95 58.91,38
  Bottom 0.254: 58.91,38 32,38 31,38 10.7,38 v7.62,34.92 | v59.92,37.95 58.96,37.95
N$11
  Top 1.016: D3.A 68.12,13.34 CN1.PWR
N$12
  Top 0.254: R10.1 28.02,3.13 R11.2 26.67,3.28 26.67,5.71 25.98,6.41 IC2.3
N$13  (via drill 0.3)
  Top 0.152: IC2.7 IC2.6
  Top 0.254: Q1.1 30.89,15.8 v30.18,15.09 | v28.57,7.62 30.05,7.62 IC2.7
  Bottom 0.254: v30.18,15.09 30.18,9.22 v28.57,7.62
N$14
  Top 0.254: IC2.1 25.98,8.95 27.94,6.99 27.94,6.35 29.21,5.08 30.05,5.08 IC2.5
N$15
  Top 0.508: U$7.VBUS 74.49,23.29 74.22,23.01 | 66.67,18.97 66.52,18.97 66.32,18.77
  Top 1.016: F1.2 52.87,15.39 62.94,15.39 66.32,18.77 66.52,18.97 | 66.67,18.97 70.18,18.97 74.22,23.01
N$16
  Top 0.152: C4.1 59.08,22.71 57.94,22.71 57.33,23.32 Y1.2
  Top 0.203: U$1.P$27 56.76,23.39 Y1.2
N$17
  Top 0.152: 57.64,24.08 57.79,24.08 | 58.33,24.62 Y1.1
  Top 0.203: U$1.P$28 56.63,24.08 57.64,24.08 | 57.79,24.08 58.33,24.62
  Top 0.406: 58.33,24.62 58.45,24.5 C5.1
N$20  (via drill 0.3)
  Top 0.152: 14.48,44.09 S1.3 | U$1.P$46 58.25,36.12 58.86,36.12 v61.29,38.56
  Top 0.254: 11.12,41.45 11.12,39.37 | 11.12,39.37 R9.1 C7.1 | v12.06,39.37 11.12,39.37
  Top 0.305: 11.12,41.45 S1.3
  Bottom 0.254: v61.29,38.56 58.55,38.56 31.88,38.56 12.88,38.56 v12.06,39.37
N$25
  Top 0.254: LED1.A 10.25,38.32 R3.1
P0[0]
  Top 0.152: U$1.P$48 59.77,38.78
  Top 0.254: 59.77,38.78 59.77,42.47 U$5.12
P0[1]
  Top 0.152: U$1.P$49 58.5,38.08
  Top 0.254: 58.5,38.08 58.5,41.2 U$5.11
P0[2]
  Top 0.152: U$1.P$50 57.18,37.33
  Top 0.254: 57.18,37.33 57.18,41.88 57.15,41.91 57.15,42.55 U$5.14
P0[3]
  Top 0.152: U$1.P$51 55.96,36.67
  Top 0.254: 55.96,36.67 55.96,41.2 U$5.13
P0[4]
  Top 0.254: U$1.P$53 50.63,32.92 50.63,34.9 49.86,35.66 49.86,36.42 53.06,39.62 53.67,39.62 54.74,40.69 54.74,42.41 U$5.16
P0[5]
  Top 0.152: U$1.P$54 50.17,32.81
  Top 0.254: 50.17,32.81 50.17,34.59 49.41,35.36 49.41,37.03 49.41,37.26 53.34,41.2 U$5.15
P0[6]
  Top 0.152: U$1.P$55 49.71,32.7 | 48.95,37.49 49,37.49
  Top 0.254: 49.71,32.7 49.71,34.29 48.95,35.05 48.95,37.19 48.95,37.49 | 49,37.49 52.15,40.64 52.15,42.47 U$5.18
P0[7]
  Top 0.152: U$1.P$56 49.25,32.59
  Top 0.254: 49.25,32.59 49.25,33.98 48.34,34.9 48.34,37.34 48.34,38.1 50.8,40.56 U$5.17
P1[2]
  Top 0.152: U$1.P$13 50.06,24 49.68,23.62 46.94,23.62 46.02,22.71 45.44,22.71
  Top 0.254: 45.44,22.71 44.53,23.62 38.18,29.97 38.18,41.2 U$5.27
P1[4]
  Top 0.152: 45.8,21.59 45.75,21.64 45.8,21.59 | U$1.P$15 50.64,23.36 50.29,23.01 48.01,23.01 46.63,21.64 46.48,21.49 45.9,21.49 45.8,21.59
  Top 0.254: 45.75,21.64 44.23,23.16 37,30.39 37,42.38 U$5.30
P1[5]
  Top 0.152: U$1.P$16 50.88,23.15 50.44,22.71 48.16,22.71 46.63,21.18 45.44,21.18 45.29,21.34
  Top 0.254: 45.29,21.34 43.92,22.71 35.64,30.99 35.64,41.2 U$5.29
P1[6]
  Top 0.152: U$1.P$18 52.61,22.45 52.61,18.9 50.63,18.9 49.86,19.66
  Top 0.254: 49.86,19.66 48.8,20.73 45.14,20.73 44.84,21.03 43.62,22.25 34.47,31.39 34.47,42.36 U$5.32
P1[7]
  Top 0.152: U$1.P$19 52.91,22.71 52.91,18.59 50.32,18.59 49.56,19.36
  Top 0.254: 49.56,19.36 48.65,20.27 44.84,20.27 44.38,20.73 43.31,21.79 33.1,32 33.1,41.2 U$5.31
P2[0]
  Top 0.152: U$1.P$62 47.97,30.48 45.29,30.48 43.46,32.31 43,32.31 | 43.31,32.31 43,32.31 | 43,32.31 42.7,32.31 42.4,32.61 42.4,32.92
  Top 0.254: 42.4,32.92 42.4,37.64 43.31,38.56 46.66,38.56 48.26,40.15 U$5.19
P2[1]
  Top 0.152: U$1.P$63 47.71,30.18 45.14,30.18 43.31,32 43.16,32 42.55,32 41.94,32.61 41.94,32.92
  Top 0.254: 41.94,32.92 41.94,37.95 43.01,39.01 45.44,39.01 47.12,40.69 47.12,42.41 U$5.22
P2[2]
  Top 0.152: U$1.P$64 47.45,29.87 44.99,29.87 43.16,31.7 42.4,31.7 41.48,32.61 41.48,32.92
  Top 0.254: 41.48,32.92 41.48,38.1 42.85,39.47 44.68,39.47 45.75,40.54 45.75,41.25 U$5.21
P2[3]
  Top 0.152: U$1.P$65 47.19,29.57 44.84,29.57 43.01,31.39 42.24,31.39 41.02,32.61 41.02,32.92
  Top 0.254: 41.02,32.92 41.02,38.25 42.7,39.93 43.77,39.93 44.53,40.69 44.53,42.47 U$5.24
P2[4]
  Top 0.152: U$1.P$66 46.93,29.26 44.68,29.26 42.85,31.09 42.09,31.09 40.57,32.61
  Top 0.254: 40.57,32.61 40.57,38.41 40.57,38.58 40.57,38.66 U$5.23
P2[5]
  Top 0.152: U$1.P$68 46.05,27.76 46.05,27.13 45.93,27 43,27 42.98,27 42.55,27.43
  Top 0.254: 42.55,27.43 40.11,29.87 40.11,29.89 40.11,32.77 40.11,38.71 40.11,38.86 41.94,40.69 41.94,42.52 U$5.26
P2[6]
  Top 0.152: U$1.P$1 46.36,27.07 46.36,26.98 46.05,26.67 42.7,26.67 42.24,27.13
  Top 0.254: 42.24,27.13 39.65,29.72 39.65,38.86 39.65,39.17 39.65,40.29 U$5.25
P2[7]
  Top 0.152: U$1.P$2 46.66,26.81 46.66,26.67 46.36,26.36 42.55,26.36 42.4,26.36 41.94,26.82
  Top 0.254: 41.94,26.82 39.2,29.57 39.2,39.17 39.2,39.32 39.2,42.72 U$5.28
P3[0]
  Top 0.152: U$1.P$29 55.83,25.45 62.82,25.45 62.97,25.45 63.09,25.45 65.46,25.45 65.53,25.45 65.84,25.76
  Top 0.254: U$5.2 72.39,42.55 72.39,32.38 72.39,32.31 65.84,25.76
P3[1]
  Top 0.152: U$1.P$30 56.09,25.76 62.67,25.76 62.79,25.76 64.49,25.76 64.49,25.78 64.77,26.06
  Top 0.254: 71.2,41.2 U$5.1 | 71.17,41.22 U$5.1 | U$5.1 71.12,32.38 71.09,32.38 64.77,26.06
P3[2]
  Top 0.152: U$1.P$31 56.35,26.06 62.51,26.06 62.64,26.06 63.52,26.06 63.55,26.06 63.86,26.36
  Top 0.254: U$5.4 69.85,42.55 69.85,32.38 69.85,32.36 63.86,26.36
P3[3]
  Top 0.152: U$1.P$32 56.61,26.36 62.36,26.36 62.79,26.36 63.09,26.67
  Top 0.254: U$5.3 68.58,32.16 63.09,26.67
P3[4]  (2 unrouted)
  Top 0.152: U$1.P$33 56.87,26.67 62.06,26.67 62.06,26.7 62.33,26.98
  Top 0.254: U$5.6 67.21,42.65 67.21,31.82 62.36,26.98 62.33,26.98
P3[5]
  Top 0.152: 57.11,27 U$1.P$34 57.13,26.98 61.42,26.98 61.72,27.28
  Top 0.254: U$5.5 66.04,31.6 61.72,27.28
P3[6]
  Top 0.152: U$1.P$36 56.73,28.96 62.21,28.96
  Top 0.254: 62.21,28.96 62.61,28.96 64.77,31.11 64.77,42.55 U$5.8
P3[7]
  Top 0.152: U$1.P$37 56.47,29.26 60.99,29.26 61.14,29.41
  Top 0.254: 61.14,29.41 64.34,32.61 64.34,35.36 63.58,36.12 63.58,41.2 U$5.7
P15[2]
  Top 0.152: 62.67,36.58 62.67,36.42 63.88,35.2 58.86,30.18 55.69,30.18 U$1.P$40
  Top 0.254: 62.67,36.58 62.67,40.23 62.21,40.69 62.21,40.84 62.21,42.57 U$5.10
P15[3]
  Top 0.152: U$1.P$41 55.58,30.63 58.7,30.63 58.86,30.63 63.43,35.2 62.06,36.58
  Top 0.254: 62.06,36.58 62.06,40.18 U$5.9
P15[5]
  Top 0.152: U$1.P$61 48.23,30.79 45.44,30.79 43.62,32.61 43.46,32.61 43.01,32.61 42.85,32.77 42.85,32.92
  Top 0.254: 42.85,32.92 42.85,37.49 43.46,38.1 47.12,38.1 47.12,38.23 49.53,40.64 49.53,42.55 U$5.20
SCL0  (via drill 0.3)
  Top 0.152: U$1.P$3 47.09,26.67 46.94,26.52 46.94,26.36 46.63,26.06 43.59,26.06 v43.28,25.76
  Top 0.254: 62.08,8.13 U$11.6 62.13,7.98 v60.05,7.98 | v55.32,8.59 54.77,9.29 R4.1 54.73,10.04 52.43,12.34 50.14,12.34 49.84,12.65 49.84,15.85 48.92,16.76 48.01,16.76 45.87,16.76 v40.08,22.55
  Top 0.305: U$11.6 62.23,7.98 63.55,7.98 64.77,6.76 64.77,6.35 64.77,5.71 SV1.4
  Bottom 0.254: v55.32,8.59 59.44,8.59 v60.05,7.98 | v43.28,25.76 v40.08,22.55
SDA0  (via drill 0.3)
  Top 0.152: R5.1 54.73,7.5 | U$1.P$4 47.53,26.49 47.24,26.21 47.24,26.06 46.94,25.76 44.5,25.76 v43.89,25.15
  Top 0.254: R5.1 55.25,7.14 v55.47,7.37 | U$11.5 | 54.73,7.5 53.82,8.1 53.82,10.16 52.25,11.73 49.53,11.73 49.38,11.89 49.38,15.39 49.07,15.7 48.28,15.7 45.72,15.7 v40.08,21.34 | 60.96,6.76 SV1.5
  Top 0.305: 60.96,6.75 60.96,6.76
  Top 0.406: 60.96,6.76 v60.35,6.76 60.96,6.76 | 60.96,6.76 U$11.5
  Bottom 0.254: v55.47,7.37 59.74,7.37 v60.35,6.76 | v43.89,25.15 v40.08,21.34
SWDCK  (via drill 0.3)
  Top 0.152: U$1.P$12 49.73,24.28 49.38,23.93 47.4,23.93 47.09,24.23 46.63,24.23 v45.72,23.32
  Top 0.254: v40.69,18.29 39.78,18.29 33.07,24.99 32.92,25.15 12.95,25.15 11.12,23.32 3.96,23.32 2.59,24.69 2.59,25.76 2.9,26.06 4.98,26.06 U$2.P$4
  Bottom 0.254: v45.72,23.32 v40.69,18.29
SWDIO  (via drill 0.3)
  Top 0.152: U$1.P$11 49.51,24.51 49.23,24.23 47.7,24.23 46.94,24.99 46.18,24.99 v45.11,23.93
  Top 0.254: v40.08,18.9 33.68,25.3 33.38,25.6 12.65,25.6 10.97,23.93 5.33,23.93 5.03,24.23 5.03,24.84 U$2.P$2
  Bottom 0.254: v45.11,23.93 v40.08,18.9
SWV  (via drill 0.3)
  Top 0.152: U$1.P$14 50.35,23.68 49.99,23.32 47.55,23.32 v46.63,22.4
  Top 0.254: v41.6,17.37 39.78,17.37 32.46,24.69 13.26,24.69 11.43,22.86 3.66,22.86 1.98,24.54 1.98,26.98 2.29,27.28 4.93,27.28 U$2.P$6
  Bottom 0.254: v46.63,22.4 v41.6,17.37
USBVCC
  Top 1.016: F1.1 30.15,13.97 Q1.3
USD_CD  (via drill 0.3 pad 0.25)
  Top 0.152: U$1.P$60 48.34,31.24 46.82,31.24 46.66,31.09 45.6,31.09 43.46,33.22 v43.46,33.98
  Top 0.254: v29.66,33.61 29.44,33.4 U1.CD1 U1.CD2
  Bottom 0.254: v29.66,33.61 43.24,33.61 v43.46,33.98
USD_CS  (via drill 0.3 pad 0.25)
  Top 0.152: U$1.P$20 53.52,22.67 v53.52,22.55 | v49.41,18.75 v49.4,18.75 49.4,18.59 49.1,18.29 48.95,18.14 48.06,18.14 47.9,18.3
  Top 0.254: U1.2 21.72,43.26 21.72,37.97 21.59,37.85 21.59,35.56 22.23,34.92 24.77,34.92 29.84,34.92 31.88,32.89 31.88,31.65 34.78,28.74 43.91,19.61 45.22,18.3 47.9,18.3
  Bottom 0.152: 53.52,22.4 v53.52,22.55 53.52,18.44 49.71,18.44 v49.41,18.75
USD_DI  (via drill 0.3 pad 0.25)
  Top 0.152: U$1.P$21 53.28,23.47 53.37,23.47 54.28,22.55 v54.28,22.25
  Top 0.254: U1.3 22.78,43.62 22.78,38.18 22.86,38.1 22.86,36.2 23.5,35.56 25.4,35.56 30.48,35.56 32.36,33.68 32.36,32.01 34.76,29.61 43.76,20.61 45.63,18.75 v48.65,18.75
  Bottom 0.152: 54.28,22.1 v54.28,22.25 54.28,18.14 49.25,18.14 v48.65,18.75
USD_DO  (via drill 0.3, 0.3 pad 0.25)
  Top 0.152: v62.97,32.16 61.9,32.16 59.31,29.57 56.21,29.57 U$1.P$38
  Top 0.254: v27.28,37.34 27.28,43.67 U1.7
  Bottom 0.254: v62.97,32.16 63.73,32.92 63.73,33.22 59.47,37.49 32.03,37.49 27.43,37.49 v27.28,37.34
USD_SCK  (via drill 0.3, 0.3 pad 0.25)
  Top 0.152: U1.5 | v62.85,33.15 62.44,33.15 59.16,29.87 55.95,29.87 U$1.P$39
  Top 0.254: v25.15,37.34 25.15,43.6 U1.5
  Bottom 0.152: v62.85,33.15 62.82,33.18
  Bottom 0.254: 62.82,33.18 59,37 32,37 28.01,37 27.74,36.73 25.76,36.73 v25.15,37.34
V+  (via drill 0.3, 0.3 pad 0.25)
  Top 0.254: R6.1 18.2,7.54 | R10.2 29.79,3.54 v29.21,4.12
  Top 0.406: 15.76,8.71 15.45,8.39
  Top 0.61: U$3.P$5 15.76,8.71 | 18.2,7.54 17.35,8.39 15.45,8.39 13.41,8.39 C19.1 10.91,7.25 9.6,5.94 v9.6,4.12
  Top 1.016: 29.79,3.54 47.35,3.54 SV1.10 | D3.C v53.98,13.34
  Bottom 0.254: v29.21,4.12 28.57,4.12
  Bottom 1.016: v9.6,4.12 28.57,4.12 v29.21,4.12 | SV1.10 48.26,8.26 51.88,11.87 53.34,13.34 v53.98,13.34
  pour Top (isolate 0.254, rank 4): 11,3.31 11,5.85 12.9,5.85 14.18,7.12 18.62,7.12 18.62,7.75 16.71,9.66 16.08,9.66 15.45,9.03 11,9.03 8.46,6.49 8.46,3.31
XRES  (via drill 0.3)
  Top 0.152: U$1.P$10 | U$1.P$10 48.92,24.54 48.01,24.54 47.09,25.45 45.41,25.45 v44.5,24.54
  Top 0.254: v13.18,30.48 13.18,32.38 C7.2 | v13.18,30.48 13.18,29.84 | 13.18,29.84 13.18,26.59 13.56,26.21 33.68,26.21 34.44,25.45 39.78,20.12 v40.08,20.12 44.96,15.24 47.85,15.24 48.77,15.24 48.92,15.09 48.92,12.8 48.92,11.58 49.23,11.28 51.82,11.28 v51.82,9.65 | U$2.P$10 5.06,30.75 v5.03,30.79 | v13.18,30.48 13.18,29.84
  Bottom 0.254: v51.82,9.65 51.82,9.14 54.61,6.35 57.15,6.35 | 58.42,4.53 SV1.6 | v44.5,24.54 v40.08,20.12 | v5.03,30.79 12.88,30.79 v13.18,30.48
  Bottom 0.305: 58.42,4.53 58.42,5.08 57.15,6.35